# EAGLE design ece411-t09-GPSClock (EAGLE 9.5.1)
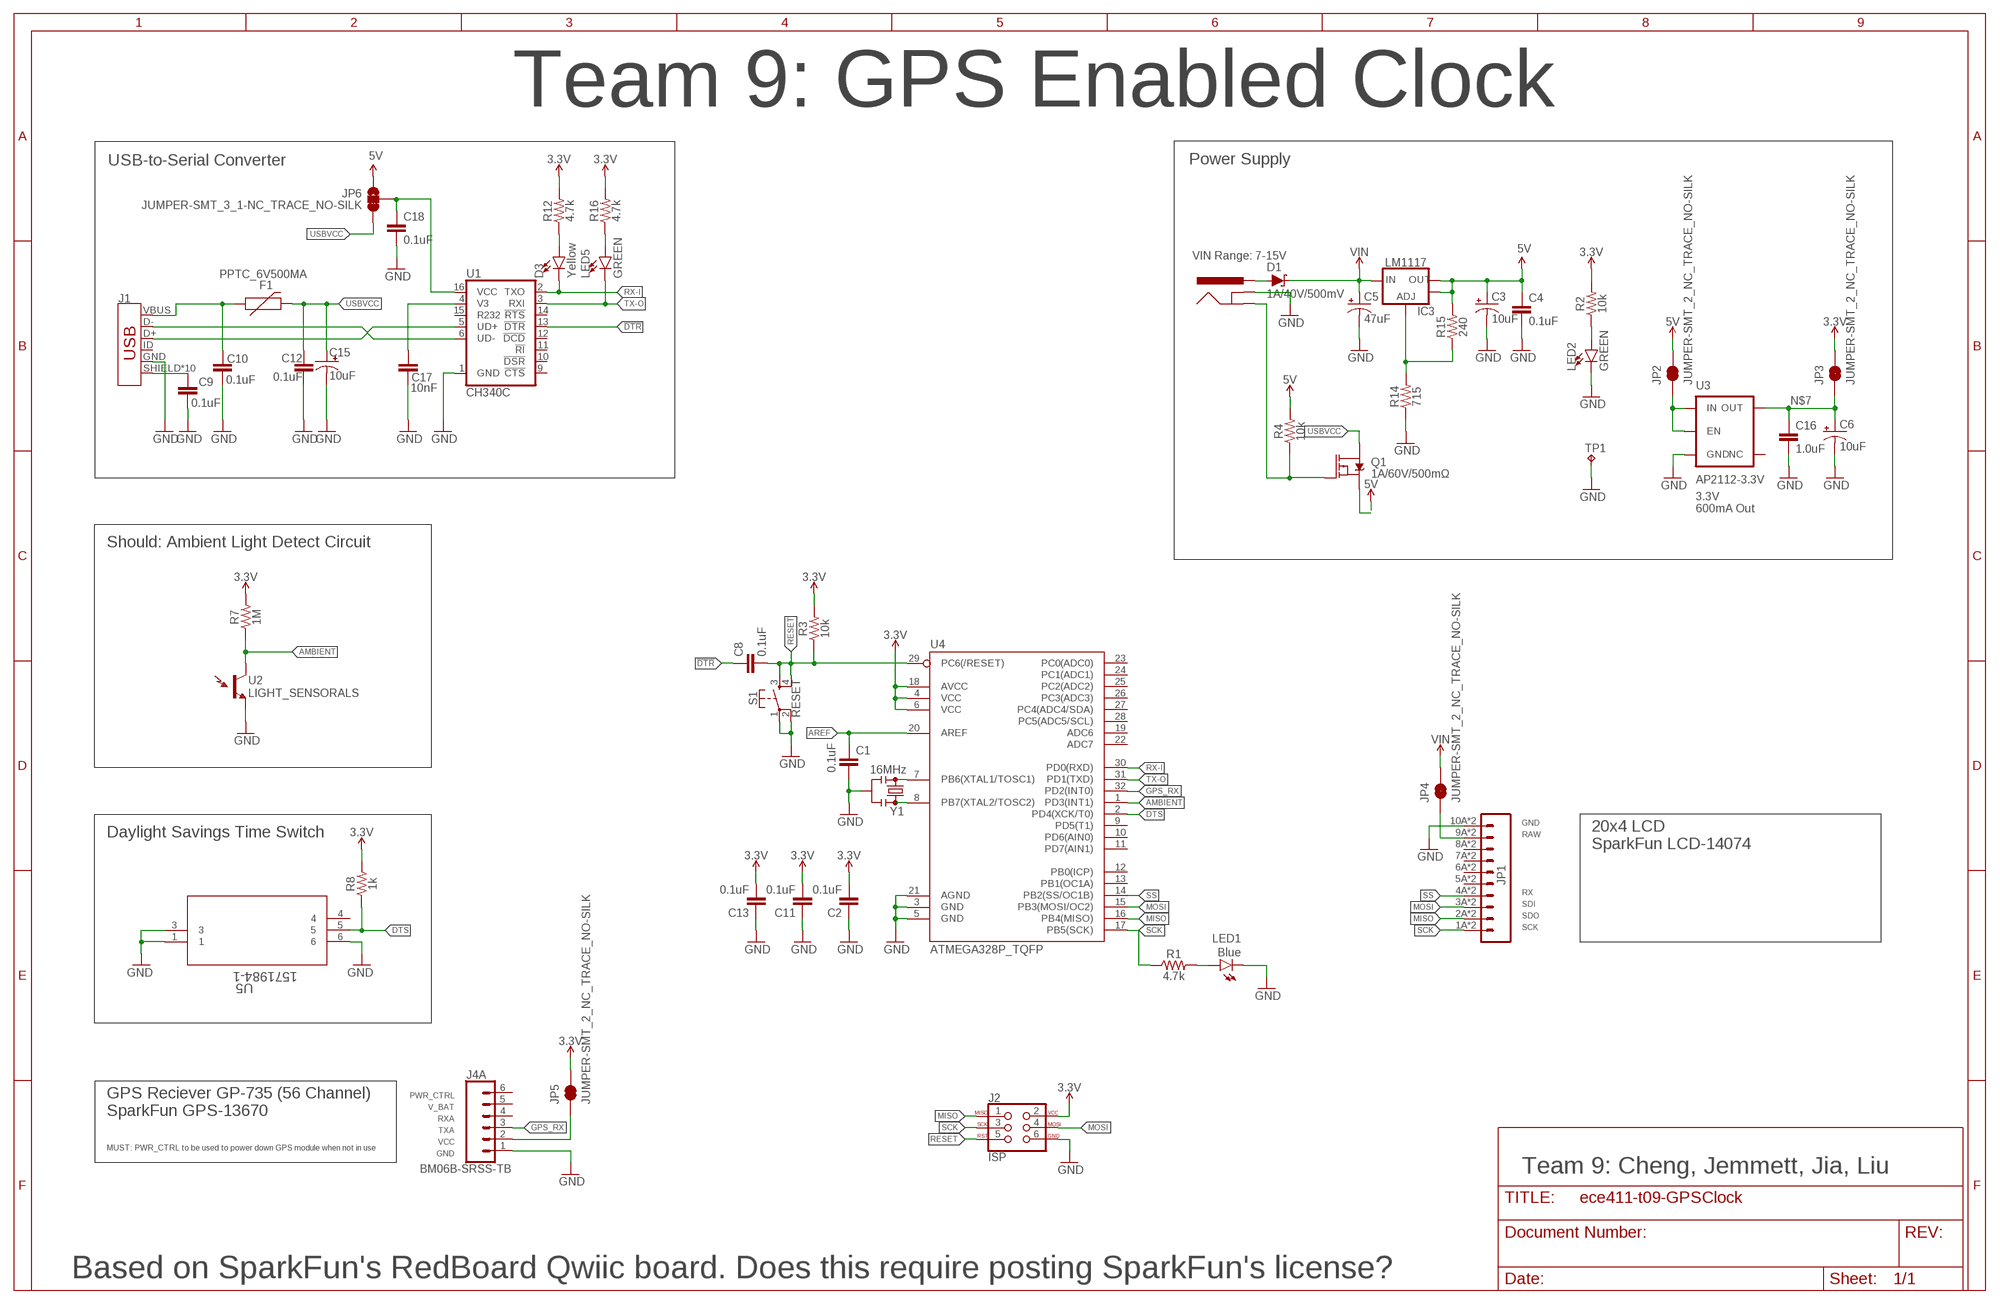
[diagram p0: schematic, sheet 1]

## Parts
C1  0.1uF  0.1UF-0603-25V-(+80/-20%)  [0603]
C2  0.1uF  0.1UF-0603-25V-(+80/-20%)  [0603]
C3  10uF  10UF-POLAR-EIA3216-16V-10%(TANT)  [EIA3216]
C4  0.1uF  0.1UF-0603-25V-(+80/-20%)  [0603]
C5  47uF  47UF-POLAR-PANASONIC_D-35V-20%  [PANASONIC_D]
C6  10uF  10UF-POLAR-EIA3216-16V-10%(TANT)  [EIA3216]
C8  0.1uF  0.1UF-0603-25V-(+80/-20%)  [0603]
C9  0.1uF  0.1UF-0603-25V-(+80/-20%)  [0603]
C10  0.1uF  0.1UF-0603-25V-(+80/-20%)  [0603]
C11  0.1uF  0.1UF-0603-25V-(+80/-20%)  [0603]
C12  0.1uF  0.1UF-0603-25V-(+80/-20%)  [0603]
C13  0.1uF  0.1UF-0603-25V-(+80/-20%)  [0603]
C15  10uF  10UF-POLAR-EIA3216-16V-10%(TANT)  [EIA3216]
C16  1.0uF  1.0UF-16V-10%(0603)  [0603-CAP]
C17  10nF  10NF/10000PF-50V-10%(0603)  [0603-CAP]
C18  0.1uF  0.1UF-0603-25V-(+80/-20%)  [0603]
D1  1A/40V/500mV  DIODE-SCHOTTKY-SS14  [SMA-DIODE]
D3  Yellow  LED-YELLOW_HIDDENSILK  [LED-1206-HIDDENSILK]
F1  PPTC_6V500MA  [0805]
IC3  LM1117  V_REG_LM1117ALT1  [SOT223-ALT1]
J1  AMP FCI 10103594-0001LF  USB_MICRO-B_HALF_PTH_MILL  [USB-MICROB-PTH-MILL]
J2  ISP  AVR_SPI_PROG_3X2SMD  [2X3_SMT_POSTS]
J3  POWER_JACKSUPER_BOMB_DIGITY  [POWER_JACK_SMD_OVERPASTE_SUPER_BOMB_DIGITY]
J4  BM06B-SRSS-TB  JST_6_PIN_HORIZONTAL  [JST-6-SMD-HORI-1.0MM]
JP1  M10SMD_COMBO  [1X10_SMD_COMBINED]
JP2  JUMPER-SMT_2_NC_TRACE_NO-SILK  [SMT-JUMPER_2_NC_TRACE_NO-SILK]
JP3  JUMPER-SMT_2_NC_TRACE_NO-SILK  [SMT-JUMPER_2_NC_TRACE_NO-SILK]
JP4  JUMPER-SMT_2_NC_TRACE_NO-SILK  [SMT-JUMPER_2_NC_TRACE_NO-SILK]
JP5  JUMPER-SMT_2_NC_TRACE_NO-SILK  [SMT-JUMPER_2_NC_TRACE_NO-SILK]
JP6  JUMPER-SMT_3_1-NC_TRACE_NO-SILK  [SMT-JUMPER_3_1-NC_TRACE_NO-SILK]
LED1  Blue  LED-BLUE_HIDDENSILK  [LED-1206-HIDDENSILK]
LED2  GREEN  LED-GREEN_HIDDENSILK  [LED-1206-HIDDENSILK]
LED5  GREEN  LED-GREEN_HIDDENSILK  [LED-1206-HIDDENSILK]
Q1  1A/60V/500mΩ  MOSFET-PCH-ZXMP6A13F  [SOT23-3]
R1  4.7k  4.7KOHM-0603-1/10W-1%  [0603]
R2  10k  10KOHM-0603-1/10W-1%  [0603]
R3  10k  10KOHM-0603-1/10W-1%  [0603]
R4  10k  10KOHM-0603-1/10W-1%  [0603]
R7  1M  1MOHM-0603-1/4W-5%  [0603]
R8  1k  1KOHM-0603-1/10W-1%  [0603]
R12  4.7k  4.7KOHM-0603-1/10W-1%  [0603]
R14  715  715OHM-0603-1/10W-1%  [0603]
R15  240  240OHM-0603-1/10W-1%  [0603]
R16  4.7k  4.7KOHM-0603-1/10W-1%  [0603]
S1  RESET  MOMENTARY-SWITCH-SPST-2-SMD-5.2MM-TALL  [TACTILE_SWITCH_SMD_5.2MM]
TP1  TP-063  [TP-063]
U1  CH340C  [SO016]
U2  LIGHT_SENSORALS  [ALS-PT19]
U3  AP2112-3.3V  V_REG_AP2112K-3.3V  [SOT23-5]
U4  ATMEGA328P_TQFP  [TQFP32-08]
U5  1571984-1  [SWITCH_1571984-1]
Y1  16MHz  RESONATOR-16MHZSMD_3.2X1.3  [RESONATOR-SMD-3.2X1.3]

## Nets
3.3V [power]: C2.2 C11.2 C13.2 J2.2 JP3.2 JP5.2 R2.2 R3.2 R7.2 R8.2 R12.2 R16.2 U4.4(VCC) U4.6(VCC) U4.18(AVCC)
5V: C3.+ C4.1 IC3.2(OUT) IC3.4(OUT) JP2.2 JP6.1 Q1.2(S) R4.2 R15.2
!DTR: C8.1 U1.13(!DTR)
AMBIENT: R7.1 U2.C(C1) U4.1(PD3(INT1))
AREF: C1.1 U4.20(AREF)
DTS: R8.1 U4.2(PD4(XCK/T0)) U5.5
GND: C1.2 C2.1 C3.- C4.2 C5.- C6.- C9.2 C10.2 C11.1 C12.2 C13.1 C15.- C16.2 C17.2 C18.2 J1.GND J2.6 J3.GND(GNDBREAK) J4.1 JP1.10A JP1.10B LED1.C LED2.C R14.1 S1.1 S1.2 TP1.1 U1.1(GND) U2.E(E1) U3.2(GND) U4.3(GND) U4.5(GND) U4.21(AGND) U5.1 U5.3 U5.6 Y1.2
GPS_RX: J4.3 U4.32(PD2(INT0))
INSERT: J3.P$4(GND) Q1.1(G) R4.1
MISO: J2.1 JP1.2A JP1.2B U4.16(PB4(MISO))
MOSI: J2.4 JP1.3A JP1.3B U4.15(PB3(MOSI/OC2))
N$1: LED1.A R1.2
N$2: LED2.A R2.1
N$3: U4.7(PB6(XTAL1/TOSC1)) Y1.1
N$4: U4.8(PB7(XTAL2/TOSC2)) Y1.3
N$5: LED5.A R16.1
N$6: C17.1 U1.4(V3)
N$7: C6.+ C16.1 JP3.1 U3.5(OUT)
N$8: JP2.1 U3.1(IN) U3.3(EN)
N$9: D3.A R12.1
N$10: JP1.9A JP1.9B JP4.1
N$11: J4.2 JP5.1
N$12: C18.1 JP6.2 U1.16(VCC)
N$13: J1.D- U1.6(UD-)
N$14: J1.D+ U1.5(UD+)
N$15: IC3.1(ADJ) R14.2 R15.1
PWRIN: D1.A J3.VIN0(PWR)
RESET: C8.2 J2.5 R3.1 S1.3 S1.4 U4.29(PC6(/RESET))
RX-I: D3.C U1.2(TXO) U4.30(PD0(RXD))
SCK: J2.3 JP1.1A JP1.1B R1.1 U4.17(PB5(SCK))
SHLD: C9.1 J1.SHIELD J1.SHIELD2(SHIELD) J1.SHIELD3(SHIELD) J1.SHIELD4(SHIELD) J1.SHIELD5(SHIELD) J1.SHIELD6(SHIELD) J1.SHIELD7(SHIELD) J1.SHIELD8(SHIELD) J1.SHIELD9(SHIELD) J1.SHIELD10(SHIELD)
SS: JP1.4A JP1.4B U4.14(PB2(SS/OC1B))
TX-O: LED5.C U1.3(RXI) U4.31(PD1(TXD))
USBVCC: C12.1 C15.+ F1.2 JP6.3 Q1.3(D)
VIN: C5.+ D1.C IC3.3(IN) JP4.2
VUSB: C10.1 F1.1 J1.VBUS
Unconnected: J1.ID J4.4 J4.5 J4.6 J4.M1 J4.M2 JP1.5A JP1.5B JP1.6A JP1.6B JP1.7A JP1.7B JP1.8A JP1.8B U1.9(!CTS) U1.10(!DSR) U1.11(!RI) U1.12(!DCD) U1.14(!RTS) U1.15(R232) U3.4(NC) U4.9(PD5(T1)) U4.10(PD6(AIN0)) U4.11(PD7(AIN1)) U4.12(PB0(ICP)) U4.13(PB1(OC1A)) U4.19(ADC6) U4.22(ADC7) U4.23(PC0(ADC0)) U4.24(PC1(ADC1)) U4.25(PC2(ADC2)) U4.26(PC3(ADC3)) U4.27(PC4(ADC4/SDA)) U4.28(PC5(ADC5/SCL)) U5.4

## Notes on the sheet
- Team 9: GPS Enabled Clock
- USB-to-Serial Converter | Power Supply
- VIN Range: 7-15V
- 3.3V
  600mA Out
- Should: Ambient Light Detect Circuit
- GND
- Daylight Savings Time Switch | RAW
- 20x4 LCD
  SparkFun LCD-14074
- RX
- SDI
- SDO
- SCK
- PWR_CTRL
- V_BAT
- GPS Reciever GP-735 (56 Channel)
  SparkFun GPS-13670
- RXA
- TXA
- VCC
- MUST: PWR_CTRL to be used to power down GPS module when not in use | GND
- Team 9: Cheng, Jemmett, Jia, Liu
- Based on SparkFun's RedBoard Qwiic board. Does this require posting SparkFun's license?

## Library data of the parts
C1 C2 C4 C8-C13 C18 = SparkFun-Capacitors:0.1UF: 0.1µF ceramic capacitors A capacitor is a passive two-terminal electrical component used to store electrical energy temporarily in an electric field.; PROD_ID: CAP-00810
C3 C6 C15 = SparkFun-Capacitors:10UF-POLAR: 10.0µF polarized capacitors A capacitor is a passive two-terminal electrical component used to store electrical energy temporarily in an electric field.; PROD_ID: CAP-00811
C5 = SparkFun-Capacitors:47UF-POLAR: 47µF polarized capacitors A capacitor is a passive two-terminal electrical component used to store electrical energy temporarily in an electric field.; PROD_ID: CAP-08478
C16 = SparkFun-Capacitors:1.0UF-16V-10%(0603): CAP-00868; PROD_ID: CAP-00868
C17 = SparkFun-Capacitors:10NF/10000PF-50V-10%(0603): CAP-00867; PROD_ID: CAP-00867
D1 = SparkFun-DiscreteSemi:DIODE-SCHOTTKY: Schottky diode A Schottky diode is a semiconductor diode which has a low forward voltage drop and a very fast switching action.; PROD_ID: DIO-08053
D3 = SparkFun-LED:LED-YELLOW: Yellow SMD LED Used in manufacturing several products at SparkFun. Packages: 0603 - SMD 0603 package[Product Link] <http://www.kingbrightusa.com/product.asp?catalog_name=LED&product_id=APT1608SYCK> 0603 -SMART - SMART SMD 0603 package (more efficient/more expensive) [Product Link] <http://www.osram-os.com/osram_os/en/products/product-catalog/led-light-emitting-diodes/smartled-0603/ly-l29k/index.jsp> LilyPad - SMD1206 package[Product Datasheet] <https://www.sparkfun.com/datasheets/DevTools/LilyPad/Q150YUS4.pdf> SparkFun Products: Blynk Board <https://www.sparkfun.com/products/13794> IOIO-OTG <https://www.sparkfun.com/products/13613> XBee Explorer Serial <https://www.sparkfun.com/products/13225>; PROD_ID: DIO-09909
F1 = SparkFun-Fuses:PPTC: Resettable Fuse PPTC Resettable Fuse. Really a sort of resistor with a polymeric positive temperature coefficient whose resistance increases dramatically with an increase in temperature. When heated by the power passing through the resistance rises causing the current to be limited, protecting the circuit. This is achieved by the transition of the polymer from a crystalline to an amorphous state where the conductive carbon separates breaking the conductive pathways found in the cool crystalline structure. When a PPTC cools back down it resumes conducting letting the circuit turn back on. SparkFun Products: SparkFun RedBoard - Programmed with Arduino <https://www.sparkfun.com/products/12757> Pro Micro - 5V/16MHz <https://www.sparkfun.com/products/12640> Arduino Pro 328 - 5V/16MHz <https://www.sparkfun.com/products/10915> MP3 Trigger <https://www.sparkfun.com/products/13720>
IC3 = Testing:V_REG_LM1117: Voltage Regulator LM1117 Standard adjustable voltage regulator but in SMD form. Spark Fun Electronics SKU : COM-00595; PROD_ID: VREG-08170
J1 = SparkFun-Connectors:USB_MICRO-B: USB Type Micro-B Connector Male/female and PTH/SMT variants SparkFun Products: SparkFun microB USB Breakout <https://www.sparkfun.com/products/12035> SparkFun USB microB Plug Breakout <https://www.sparkfun.com/products/10031> SparkFun ESP8266 Thing <https://www.sparkfun.com/products/13231>; PROD_ID: CONN-13711
J2 = SparkFun-Connectors:AVR_SPI_PROG_3X2: AVR ISP 6 Pin This is the reduced ISP connector for AVR programming. Common on Arduino. This footprint will take up less PCB space and can be used with a 10-pin to 6-pin adapter such as SKU: BOB-08508 **Special note about "TEST_POINT" package. The stop mask is on the top side, so if you want your programming test points to be on the bottom of your board, make sure to place this package on the bottom side of the board. This also ensure that the orientation to program from the bottom side will be correct.; PROD_ID: CONN-11415
J3 = Testing:POWER_JACK: Power Jack This is the standard 5.5mm barrel jack for power. The PTH is the most common, proven, reliable, footprint. All others are experimental. The Slot footprint only works if the mill layer is transmitted to the PCB fab house so be warned. Spark Fun Electronics SKU : PRT-00119. Mating wall wart : TOL-00298 (and others); PROD_ID: CONN-08106
J4 = SparkFun-Connectors:JST_6_PIN_HORIZONTAL: JST 6 pin horizontal connector JST-SH type. Here is the connector we sell at SparkFun: name <link> (XXX-00000) Datasheet <http://www.sparkfun.com/datasheets/GPS/EM406-SMDConnector-eSH.pdf> It was used on these SparkFun products: name <link> (XXX-00000) name <link> (XXX-00000); PROD_ID: XXX-00000
JP1 = SparkFun-Connectors:M10: Header 10 Standard 10-pin 0.1" header. Use with straight break away headers (SKU : PRT-00116), right angle break away headers (PRT-00553), swiss pins (PRT-00743), machine pins (PRT-00117), and female headers (PRT-00115).; PROD_ID: CONN-11219
JP2-JP5 = SparkFun-Jumpers:JUMPER-SMT_2_NC_TRACE: Normally closed trace jumper This jumper has a trace between two pads so it's normally closed (NC). Use a razor knife to open the connection. For best results follow the IPC guidelines for cutting traces: Cutout at least 0.063 mm (0.005 in). Remove all loose material to clean up the cut area. Seal the cut with an approved epoxy. Reapply solder to reclose the connection.
JP6 = SparkFun-Jumpers:JUMPER-SMT_3_1-NC_TRACE: Normally closed trace jumper (1 of 2 connections) This jumper has a trace between two pads so it's normally closed (NC). The other connection is normally open (NO). Use a razor knife to open the connection. For best results follow the IPC guidelines for cutting traces: Cutout at least 0.063 mm (0.005 in). Remove all loose material to clean up the cut area. Seal the cut with an approved epoxy. Reapply solder to reclose the connection, or to close the NO connection.
LED1 = SparkFun-LED:LED-BLUE: Blue SMD LED Used in manufacturing of various products at SparkFun Packages: 0603 - SMD 0603 package [Product Link] <http://www.digikey.com/product-detail/en/SMLE12BC7TT86/511-1589-2-ND/1641808> 1206 - SMD1206 package [Product Link] <http://www.digikey.com/product-detail/en/lite-on-inc/LTST-C150TBKT/160-1643-1-ND/573584> SparkFun Products: ESP8266 Thing-Dev Board <https://www.sparkfun.com/products/13711> RedBoard <https://www.sparkfun.com/products/12757>; PROD_ID: DIO-09911
LED2 = SparkFun-LED:LED-GREEN: Green SMD LED Used in manufacturing of various products at SparkFun Packages: 0603 - SMD 0603 package [Product Link] <http://www.futureelectronics.com/en/technologies/semiconductors/optoelectronics/leds/Pages/9894312-LTST-C190GKT.aspx?CrossPart=HSMG-C190&IM=0> LilyPad 1206 - SMD1206 LilyPad package [Product Link] <http://www.futureelectronics.com/en/Technologies/Product.aspx?ProductID=IN150NGHARVATEKCORPORATION2049943&IM=0> 1206 - SMD1206 package [Product Link] <http://www.futureelectronics.com/en/technologies/semiconductors/optoelectronics/leds/Pages/8315665-LTST-C150KGKT.aspx?IM=0> 1206 Bottom Mount -SMD 1206 Bottom Mount [Product Link] <http://www.digikey.com/product-detail/en/lite-on-inc/LTST-C230KGKT/160-1456-1-ND/386854> SparkFun Products: Pro Mini 328 -5V <https://www.sparkfun.com/products/821> RedBoard <https://www.sparkfun.com/products/12757> MP3 Trigger <https://www.sparkfun.com/products/13720> Makey Makey <https://www.sparkfun.com/products/11076>; PROD_ID: DIO-09910
LED5 = SparkFun-LED:LED-GREEN: Green SMD LED Used in manufacturing of various products at SparkFun Packages: 0603 - SMD 0603 package [Product Link] <http://www.futureelectronics.com/en/technologies/semiconductors/optoelectronics/leds/Pages/9894312-LTST-C190GKT.aspx?CrossPart=HSMG-C190&IM=0> LilyPad 1206 - SMD1206 LilyPad package [Product Link] <http://www.futureelectronics.com/en/Technologies/Product.aspx?ProductID=IN150NGHARVATEKCORPORATION2049943&IM=0> 1206 - SMD1206 package [Product Link] <http://www.futureelectronics.com/en/technologies/semiconductors/optoelectronics/leds/Pages/8315665-LTST-C150KGKT.aspx?IM=0> 1206 Bottom Mount -SMD 1206 Bottom Mount [Product Link] <http://www.digikey.com/product-detail/en/lite-on-inc/LTST-C230KGKT/160-1456-1-ND/386854> SparkFun Products: Pro Mini 328 -5V <https://www.sparkfun.com/products/821> RedBoard <https://www.sparkfun.com/products/12757> MP3 Trigger <https://www.sparkfun.com/products/13720> Makey Makey <https://www.sparkfun.com/products/11076>; PROD_ID: DIO-00862
Q1 = SparkFun-DiscreteSemi:MOSFET-PCH: P-channel MOSFETs Voltage controlled devices that allow control of high current outputs.; PROD_ID: TRANS-08285
R1 R12 R16 = SparkFun-Resistors:4.7KOHM: 4.7kΩ resistor A resistor is a passive two-terminal electrical component that implements electrical resistance as a circuit element. Resistors act to reduce current flow, and, at the same time, act to lower voltage levels within circuits. - Wikipedia; PROD_ID: RES-07857
R2-R4 = SparkFun-Resistors:10KOHM: 10kΩ resistor A resistor is a passive two-terminal electrical component that implements electrical resistance as a circuit element. Resistors act to reduce current flow, and, at the same time, act to lower voltage levels within circuits. - Wikipedia; PROD_ID: RES-00824
R7 = SparkFun-Resistors:1MOHM: 1MΩ resistor A resistor is a passive two-terminal electrical component that implements electrical resistance as a circuit element. Resistors act to reduce current flow, and, at the same time, act to lower voltage levels within circuits. - Wikipedia; PROD_ID: RES-07868
R8 = SparkFun-Resistors:1KOHM: 1kΩ resistor A resistor is a passive two-terminal electrical component that implements electrical resistance as a circuit element. Resistors act to reduce current flow, and, at the same time, act to lower voltage levels within circuits. - Wikipedia; PROD_ID: RES-07856
R14 = SparkFun-Resistors:715OHM: 715Ω resistor A resistor is a passive two-terminal electrical component that implements electrical resistance as a circuit element. Resistors act to reduce current flow, and, at the same time, act to lower voltage levels within circuits.; PROD_ID: RES-07850
R15 = SparkFun-Resistors:240OHM: 240Ω resistor A resistor is a passive two-terminal electrical component that implements electrical resistance as a circuit element. Resistors act to reduce current flow, and, at the same time, act to lower voltage levels within circuits.; PROD_ID: RES-07849
S1 = SparkFun-Switches:MOMENTARY-SWITCH-SPST-2: Momentary Switch (Pushbutton) - SPST - Two Circuits Normally-open (NO) SPST momentary switches (buttons, pushbuttons). Schematic symbol includes two switch circuits. Variants SMD-4.6MMX2.8MM - 4.60mm x 2.80mm Tactile Momentary Button Switch - Used on SparkFun SAMD21 Mini Breakout <https://www.sparkfun.com/products/13664> SMD-5.2MM - Mini Pushbutton Switch - SMD <https://www.sparkfun.com/products/8720> - Used on Arduino Pro Mini <https://www.sparkfun.com/products/11114>; PROD_ID: SWCH-14139
TP1 = keystone:TP: TEST POINT PCB Vertical Mount
U1 = SparkFun-IC-Comms:CH340C; PROD_ID: IC-14038
U2 = SparkFun-Sensors:LIGHT_SENSOR: Ambient Light Sensors - Phototransistors Low cost ambient light sensors, consisting of a phototransistor in miniature SMD packages. Output voltage varies with light intensity. SparkFun Products ALS-PT19 Light Sensor <https://www.sparkfun.com/products/12566> (SEN-12566) Ambient Light Sensor - TEMT6000 <https://www.sparkfun.com/products/8348> (SEN-08348) SparkFun Ambient Light Sensor Breakout - TEMT60000 <https://www.sparkfun.com/products/8688> (SEN-08688); PROD_ID: IC-11836; SF_ID: SEN-12566
U3 = SparkFun-PowerIC:V_REG_AP2112: AP2112 - 600mA CMOS LDO Regulator w/ Enable The AP2112 is CMOS process low dropout linear regulator with enable function, the regulator delivers a guaranteed 600mA (min.) continuous load current. Features Output Voltage Accuracy: ±1.5% Output Current: 600mA (Min.) Foldback Short Current Protection: 50mA Enable Function to Turn ON/OFF VOUT Low Dropout Voltage (3.3V): 250mV (Typ.) @IOUT=600mA Excellent Load Regulation: 0.2%/A (Typ.) Excellent Line Regulation: 0.02%/V (Typ.) Low Quiescent Current: 55μA (Typ.) Low Standby Current: 0.01μA (Typ.) Low Output Noise: 50μVRMS PSRR: 100Hz -65dB, 1kHz -65dB OTSD Protection Stable with 1.0μF Flexible Cap: Ceramic, Tantalum and Aluminum Electrolytic Operation Temperature Range: -40°C to 85°C ESD: MM 400V, HBM 4000V; PROD_ID: VREG-12457; VALUE: 3.3V
U4 = SparkFun-IC-Microcontroller:ATMEGA328P_TQFP; PROD_ID: IC-09069
U5 = TE 1571984-1:1571984-1; MANUFACTURER_PART_NUMBER: 15719841; VENDOR: TE Connectivity
Y1 = SparkFun-Clocks:RESONATOR-16MHZ: 16MHz Resonator Digikey Example <http://www.digikey.com/product-detail/en/murata-electronics-north-america/CSTCE16M0V53-R0/490-1198-1-ND/584635> Frequency: 16MHz Frequency Stability: ±0.3% Frequency Tolerance: ±0.5% Capacitance: 15pF; PROD_ID: XTAL-08900

## Net classes
1 power: width 0.178 mm

## Board
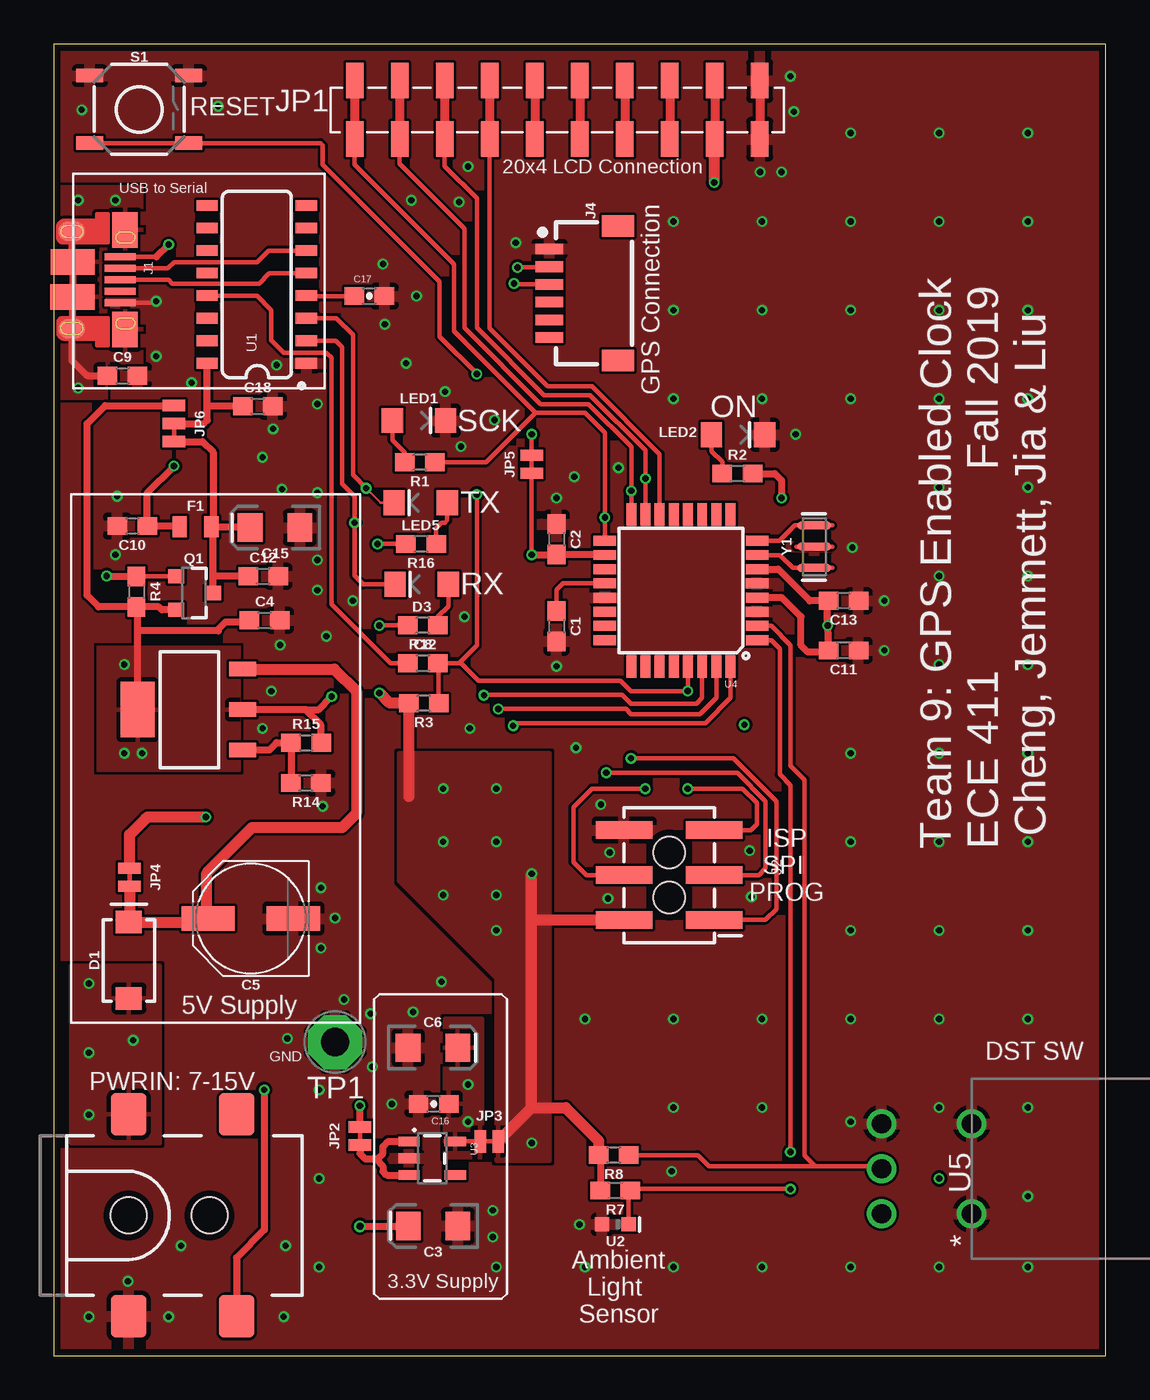
[diagram p1: board, top side]
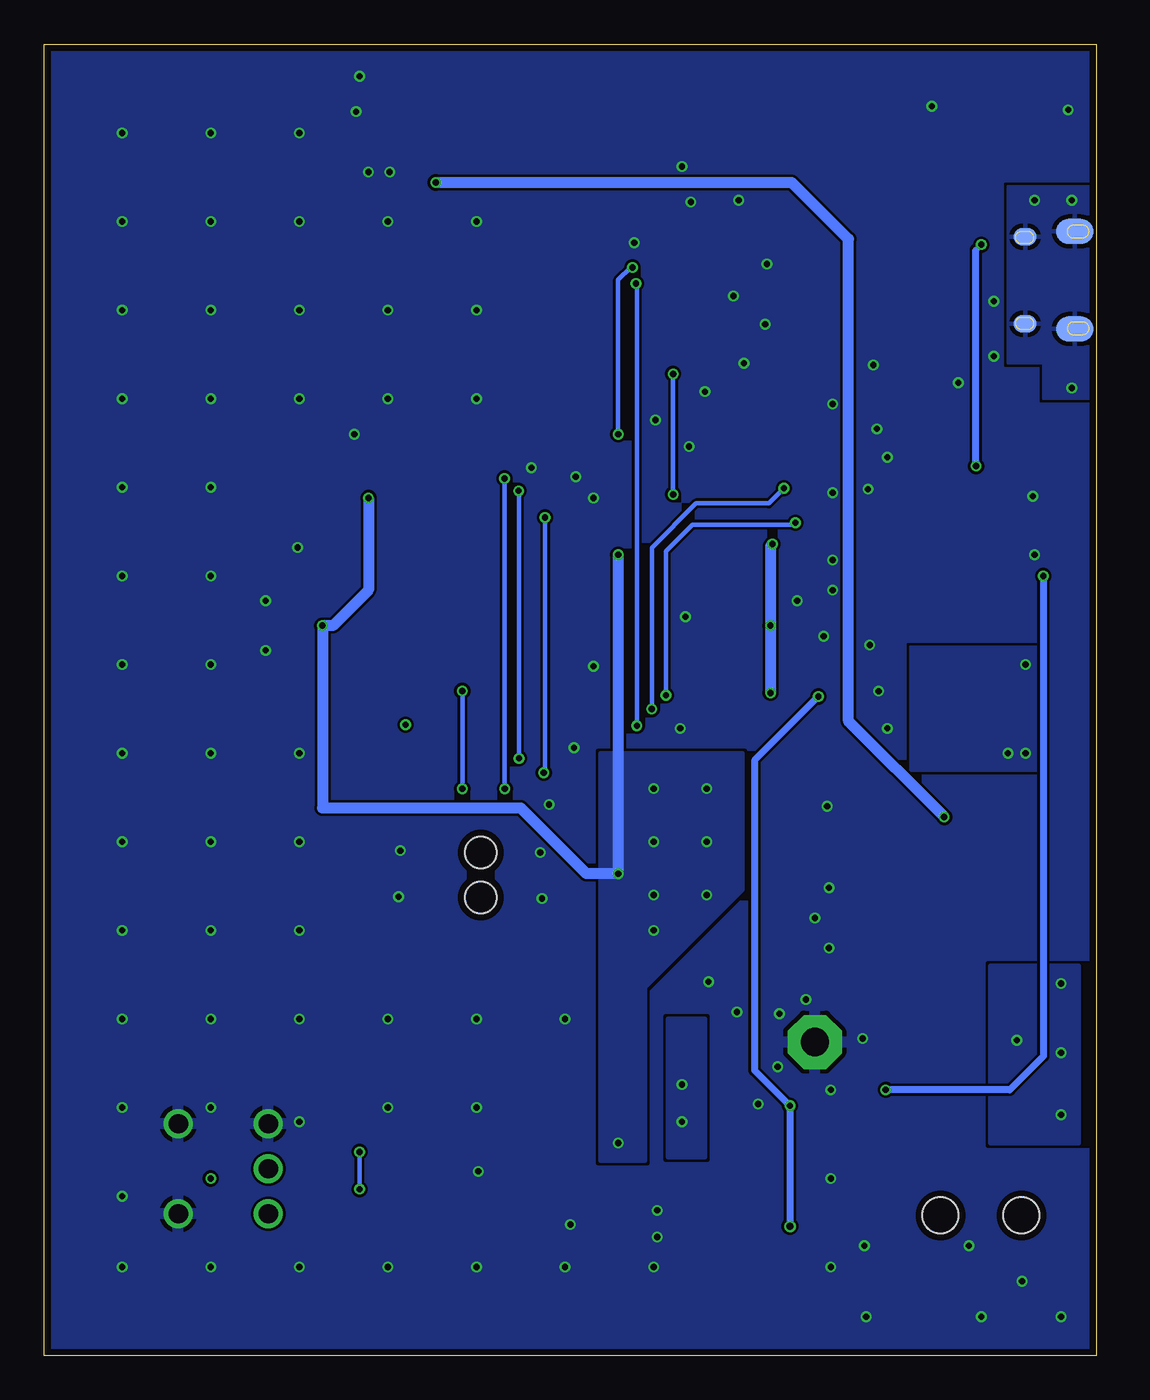
[diagram p2: board, bottom side, seen from below]

Size 59.4 x 74 mm. Coordinates in mm from the lower left corner, seen from the top.
Outline: 0,0 59.4,0 59.4,74 0,74 0,0
Copper layers (1*16): Top 0.035559375mm / dielectric 1.6mm / Bottom 0.035559375mm
Design rules "oshpark-2layer": minimum track width 6mil, minimum drill 10mil, track to track 6mil, track to pad 6mil, pad to pad 6mil, via to via 6mil, smd to smd 6mil, copper to edge 15mil, drill to drill 6mil, minimum pad ring 5mil, minimum via ring 5mil, stop-mask expansion 2.5mil, vias tented up to drill 0mil, thermal gap 10mil

### Footprints (pad centres in the part's own frame; a part is rotated, then mirrored left to right if it is on the bottom)
0603 = smd 1.1 x 1: 1 -0.85,0; 2 0.85,0
EIA3216 = smd 1.4 x 1.6: + 1.4,0; - -1.4,0
PANASONIC_D = smd 3 x 1.4: + 2.4,0; - -2.4,0
0603-CAP = smd 1.1 x 1: 1 -0.85,0; 2 0.85,0
SMA-DIODE = smd 1.27 x 1.47: A -2.15,0; C 2.15,0
LED-1206-HIDDENSILK = smd 1.2 x 1.4: A -1.5,0; C 1.5,0
0805 = smd 0.8 x 1.2: 1 -0.9,0; 2 0.9,0
SOT223-ALT1 = smd 0.813 x 1.524: 1 -2.271,-3.02; 2 0,-3.02; 3 2.288,-3.02 | smd 3.124 x 1.905: 4 0,2.921
USB-MICROB-PTH-MILL = smd 0.4 x 1.75: D+ 0.031,1.331; D- -0.619,1.331; GND 1.331,1.331; ID 0.681,1.331; VBUS -1.269,1.331 | smd 2 x 1.46: SHIELD -2.794,1.606; SHIELD2 2.831,1.606 | smd 1.425 x 2.5: SHIELD3 -0.979,-1.349; SHIELD4 0.996,-1.352 | smd 1.4 x 2.1 bottom: SHIELD5 -2.7,-1.2; SHIELD7 2.8,-1.2 | smd 1.1 x 1.5: SHIELD6 2.8,-1.4; SHIELD8 -2.7,-1.4 | smd 1 x 1.3 bottom: SHIELD9 -2.4,1.6; SHIELD10 2.5,1.6
2X3_SMT_POSTS = smd 1 x 3.17: 1 -2.54,-2.54; 2 -2.54,2.54; 3 0,-2.54; 4 0,2.54; 5 2.54,-2.54; 6 2.54,2.54 | hole 1.8: -1.27,0; 1.27,0
POWER_JACK_SMD_OVERPASTE_SUPER_BOMB_DIGITY = smd 2 x 2.4: GND 0,-5.7; P$4 6.1,-5.7; VIN0 0,5.7; VIN1 6.1,5.7 | hole 2.032: 0,0; 4.572,0
JST-6-SMD-HORI-1.0MM = smd 0.6 x 1.55: 1 -2.5,-4.775; 2 -1.5,-4.775; 3 -0.5,-4.775; 4 0.5,-4.775; 5 1.5,-4.775; 6 2.5,-4.775 | smd 1.2 x 1.8: M1 -3.8,-0.9; M2 3.8,-0.9
1X10_SMD_COMBINED = smd 1 x 2: 1A 0,1.65; 1B 0,-1.65; 2A 2.54,1.65; 2B 2.54,-1.65; 3A 5.08,1.65; 3B 5.08,-1.65; 4A 7.62,1.65; 4B 7.62,-1.65; 5A 10.16,1.65; 5B 10.16,-1.65; 6A 12.7,1.65; 6B 12.7,-1.65; 7A 15.24,1.65; 7B 15.24,-1.65; 8A 17.78,1.65; 8B 17.78,-1.65; 9A 20.32,1.65; 9B 20.32,-1.65; 10A 22.86,1.65; 10B 22.86,-1.65
SMT-JUMPER_2_NC_TRACE_NO-SILK = smd 0.635 x 1.27: 1 -0.508,0; 2 0.508,0
SMT-JUMPER_3_1-NC_TRACE_NO-SILK = smd 0.635 x 1.27: 1 -1.016,0; 2 0,0; 3 1.016,0
SOT23-3 = smd 0.8 x 0.9: 1 -0.95,-1; 2 0.95,-1; 3 0,1.1
TACTILE_SWITCH_SMD_5.2MM = smd 1.524 x 0.762: 1 -2.794,1.905; 2 2.794,1.905; 3 -2.794,-1.905; 4 2.794,-1.905
TP-063 = drill 1.6 pad 3.048 octagon: 1 0,0
SO016 = smd 0.6 x 1.2: 1 -4.445,-2.8; 2 -3.175,-2.8; 3 -1.905,-2.8; 4 -0.635,-2.8; 5 0.635,-2.8; 6 1.905,-2.8; 7 3.175,-2.8; 8 4.445,-2.8; 9 4.445,2.8; 10 3.175,2.8; 11 1.905,2.8; 12 0.635,2.8; 13 -0.635,2.8; 14 -1.905,2.8; 15 -3.175,2.8; 16 -4.445,2.8
ALS-PT19 = smd 0.8 x 0.8: C -0.75,0; E 0.75,0
SOT23-5 = smd 0.55 x 1.2: 1 -0.95,-1.3; 2 0,-1.3; 3 0.95,-1.3; 4 0.95,1.3; 5 -0.95,1.3
TQFP32-08 = smd 1.27 x 0.559: 1 -4.293,2.8; 2 -4.293,2; 3 -4.293,1.2; 4 -4.293,0.4; 5 -4.293,-0.4; 6 -4.293,-1.2; 7 -4.293,-2; 8 -4.293,-2.8; 17 4.293,-2.8; 18 4.293,-2; 19 4.293,-1.2; 20 4.293,-0.4; 21 4.293,0.4; 22 4.293,1.2; 23 4.293,2; 24 4.293,2.8 | smd 0.559 x 1.27: 9 -2.8,-4.293; 10 -2,-4.293; 11 -1.2,-4.293; 12 -0.4,-4.293; 13 0.4,-4.293; 14 1.2,-4.293; 15 2,-4.293; 16 2.8,-4.293; 25 2.8,4.293; 26 2,4.293; 27 1.2,4.293; 28 0.4,4.293; 29 -0.4,4.293; 30 -1.2,4.293; 31 -2,4.293; 32 -2.8,4.293
SWITCH_1571984-1 = drill 1.092 pad 1.6: 1 -5.08,0; 3 0,0; 4 -5.08,5.08; 5 -2.54,5.08; 6 0,5.08
RESONATOR-SMD-3.2X1.3 = smd 0.45 x 1.905: 1 -1.2,0; 2 0,0; 3 1.2,0

### Placement (x,y rotation side)
C1  28.4,41.16 270 top
C2  28.4,46.07 270 top
C3  21.43,7.32 180 top
C4  11.92,41.5 0 top
C5  11.14,24.67 180 top
C6  21.42,17.38 0 top
C8  20.86,39.08 0 top
C9  3.9,55.3 0 top
C10  4.45,46.82 180 top
C11  44.6,39.8 180 top
C12  11.84,43.98 0 top
C13  44.6,42.6 180 top
C15  12.51,46.73 180 top
C16  21.46,14.21 180 top
C17  17.83,59.79 0 top
C18  11.53,53.58 0 top
D1  4.25,22.31 90 top
D3  20.79,43.53 180 top
F1  8.02,46.77 0 top
IC3  7.67,36.46 90 top
J1  2.43,60.74 270 top
J2  34.76,27.12 90 top
J3  4.24,7.92 0 top
J4  32.77,59.95 270 top
JP1  17.01,70.3 0 top
JP2  17.3,12.4 90 top
JP3  24.6,12.1 0 top
JP4  4.3,27 270 top
JP5  27,50.3 270 top
JP6  6.8,52.6 270 top
LED1  20.63,52.77 0 top
LED2  38.65,51.97 0 top
LED5  20.73,48.13 180 top
Q1  7.92,43.04 270 top
R1  20.68,50.42 180 top
R2  38.61,49.78 0 top
R3  20.9,36.82 180 top
R4  4.68,43.11 270 top
R7  31.72,9.32 180 top
R8  31.63,11.32 180 top
R12  20.84,41.22 180 top
R14  14.25,32.32 180 top
R15  14.26,34.59 0 top
R16  20.75,45.81 180 top
S1  4.84,70.33 0 top
TP1  15.9,17.7 0 top
U1  11.48,60.45 90 top
U2  31.72,7.41 180 top
U3  21.38,11.14 270 top
U4  35.42,43.18 180 top
U5  51.83,13.09 90 top
Y1  42.95,45.65 90 top

### Tracks (layer width: path | path; a pad name or v marks a point on that pad's centre or on a via)
3.3V  (via drill 0.35)
  Top 0.254: JP5.2 v27,45.2 | 43.7,42.55 C13.2 | C11.2 43.65,39.7 | v18.4,41.2 18.42,41.22 R12.2 | v18.3,45.8 v18.31,45.81 R16.2
  Top 0.406: U4.6 40.92,44.38 42.7,42.6 C13.2 | R2.2 40.72,49.78 41.1,49.4 v41.1,48.4 | 43.7,42.55 v43.7,41.2 C11.2 | 43.65,39.7 42.6,39.7 42.2,40.1 42.2,41.7 41.12,42.78 U4.4 | 27.08,24.58 27,24.5 | R8.2 30.87,11.23 R7.2 | v27,45.2 28.38,45.2 C2.2 31.09,45.22 U4.18
  Top 0.61: 20.05,31.55 R3.2 18.98,36.82 v18.4,37.4 | JP3.2 27,13.99 | 27,13.99 27,24.5 v27,27.2 | 27,13.99 28.91,13.99 30.78,12.12 R8.2 | J2.2 27.08,24.58
  Bottom 0.61: v18.3,45.8 18.4,45.7 v18.4,41.2 v18.4,37.4 | v27,45.2 v27,27.2 28.8,27.2 32.5,30.9 43.7,30.9 v43.7,41.2 43.1,41.2 41.1,43.2 v41.1,48.4
  other vias: 22,32 25,32 22,29 22,26 25,29 25,26 25,24 27,12
  pour Top: 25,11 25,21.3 19.5,26.8 19.5,34 28,34 28,11
  pour Bottom: 25.5,11 25.5,20.8 20,26.3 20,34 28,34 28,11
5V  (via drill 0.35, 0.4)
  Top 0.152: R15.2 | 4.75,42.19 R4.2
  Top 0.406: R15.2 15.1,35.6 14.24,36.46 | 14.24,36.46 IC3.2 | Q1.2 6.11,42.09 5.94,42.26 R4.2 2.54,42.26 1.9,42.9 1.9,52.6 2.92,53.62 JP6.1 | IC3.4 4.75,41 | 4.75,41 4.75,42.19 | 14.24,36.46 14.96,36.46 v15.7,37.2 | JP2.2 v17.3,14.1 | C4.1 10.97,41.4 9.7,41.4 9.3,41 9.3,40.9 4.85,40.9 4.75,41 | v17.3,7.3 20.01,7.3 C3.+
  Bottom 0.406: v15.7,37.2 19.3,33.6 19.3,16.1 v17.3,14.1 v17.3,7.3
  other vias: 5,34 4,34 4,39
  pour Top: 10.5,40 10.5,33 2.5,33 2.5,40
  pour Bottom: 2.5,40 10.5,40 10.5,33 2.5,33
!DTR
  Top 0.254: U1.13 11.48,59.81 12.3,59 12.3,57.3 13,56.6 15.4,56.6 15.7,56.3 15.7,42.4 19.02,39.08 C8.1
AMBIENT  (via drill 0.35)
  Top 0.152: 32.47,9.22 R7.1 32.67,9.42 | 41.58,9.42 v41.6,9.4
  Top 0.254: U2.C 32.47,9.22 | U4.1 40.52,40.38 41,39.9 41,32.8 41.6,32.2 v41.6,11.5 | 41.58,9.42 32.67,9.42
  Bottom 0.254: v41.6,9.4 v41.6,11.5
AREF
  Top 0.254: U4.20 28.77,43.58 28.4,43.21 C1.1
DTS
  Top 0.152: U5.5 46.6,10.7
  Top 0.254: R8.1 36.38,11.32 37,10.7 43,10.7 | 46.6,10.7 43,10.7 | U4.2 40.52,41.18 41.6,40.1 41.6,33.3 42.4,32.5 42.4,11.3 43,10.7
GND  (via drill 0.35)
  Top 0.254: J1.GND 5.71,59.41 v5.8,59.5
  other vias: 9.3,70.5 7.8,54.9 5.8,56.4 11.8,50.7 29.4,49.6 19.9,56 30.9,31.1 28.4,38.9 28.4,48.4 41.9,52 46.9,42.6 46.9,39.8 45.1,45.6 31.4,28.4 15.1,26.4 15.9,24.7 15.1,23 13,2.2 2,2.2 13.2,17.9 16.4,20.1 40,14 35,14 30,19 35,19 40,19 45,19 50,19 55,19 55,14 55,9 50,14 45,24 50,24 55,24 55,29 50,29 45,29 45,34 50,34 55,34 50,39 55,39 50,44 55,44 35,54 40,54 50,49 55,49 55,54 50,54 45,54 35,59 40,59 45,59 50,59 55,59 35,64 40,64 45,64 50,64 55,64 55,69 50,69 45,69 34.9,10.4 6.5,2.2 11.8,35.4 12.3,37.5 16.9,42.6 23.5,35.4 29.5,34.3 15.2,31 20.3,19.4 17.9,19.3 18,16.3 24.8,8.2 24.8,6.7 19.1,14.2 45,13.2 29.7,7.4 15.4,40.6 12.8,40.1 14.9,43.2 14.9,44.9 14.9,48.7 12.9,48.9 3.5,45.2 3.6,48.5 12.4,52.3 14.9,53.7 12.6,55.9 18.6,61.6 20.5,59.8 18.7,58.2 1.6,70.3 39.9,66.8 41.1,66.8 41.8,70.2 41.6,72.2 26.1,62.8 24.9,52.8 23,51.3 22.1,54.4 23.2,41.7 31.9,50.1 31.3,25.8 39.4,25.9 39.3,28.5 21.9,21.1 20.2,65.2 22.9,65.1 23.4,67.1 7.2,6.2 13.1,6.2 4.2,4.2 55,5 50,5 45,5 40,5 35,5 30,5 25,5 15,5 15,10 15,15
  pour Top (rank 2): 0,74 0,0 59.5,0 59.5,74
  pour Bottom (rank 2): 0,74 59.5,74 59.5,0 0,0
GPS_RX  (via drill 0.35)
  Top 0.152: 26.05,60.45 v26,60.5
  Top 0.254: U4.32 38.22,37.12 36.8,35.7 26.1,35.7 v25.95,35.55 | J4.3 26.05,60.45
  Bottom 0.254: v25.95,35.55 25.95,60.45 v26,60.5
INSERT  (via drill 0.35)
  Top 0.152: R4.1 4.71,43.99
  Top 0.254: 4.71,43.99 Q1.1
  Top 0.406: R4.1 3.04,43.96 v3,44 | v11.9,15 11.9,7.1 10.34,5.54 J3.P$4
  Bottom 0.406: v3,44 3,16.9 4.9,15 v11.9,15
MISO  (via drill 0.35)
  Top 0.152: J2.1 37.32,24.6
  Top 0.254: 37.32,24.6 40.2,24.6 40.8,25.2 40.8,31.3 38.39,33.71 v32.6,33.71 | U4.16 v32.62,48.8 32.62,51.28 30.2,53.7 27.5,53.7 23.2,58 23.2,63.6 19.55,67.25 JP1.2B JP1.2A
  Bottom 0.254: v32.6,33.71 32.6,48.78 v32.62,48.8
MOSI  (via drill 0.35)
  Top 0.254: J2.4 30.08,27.12 29.35,27.85 29.35,30.95 30.39,31.99 v33.4,31.99 | U4.15 v33.42,49.5 33.42,51.08 30.3,54.2 27.7,54.2 23.9,58 23.9,65.3 22.09,67.11 JP1.3B JP1.3A
  Bottom 0.152: 33.42,32.01 v33.4,31.99
  Bottom 0.254: v33.42,49.5 33.42,32.01
N$1
  Top 0.254: LED1.A 19.13,51.67 19.83,50.97 R1.2
N$2
  Top 0.254: LED2.A 37.15,51.05 37.76,50.44 R2.1
N$3
  Top 0.254: U4.7 41.02,45.18 41.75,44.45 Y1.1
N$4
  Top 0.254: U4.8 40.98,45.98 41.85,46.85 Y1.3
N$5
  Top 0.254: LED5.A 22.23,47.13 22.1,47 21.9,47 21.6,46.7 R16.1
N$6
  Top 0.152: U1.4 14.3,59.79
  Top 0.254: 14.3,59.79 C17.1
N$7  (via drill 0.35)
  Top 0.254: JP3.1 U3.5
  other vias: 23.4,13.2 23.4,15.3
  pour Bottom: 22.1,19 22.1,11.2 24.2,11.2 24.2,19
  pour Top: 22.1,19 22.1,11.2 24.2,11.2 24.2,19
N$8
  Top 0.152: 18.2,11.1 18.3,11.1
  Top 0.406: JP2.1 17.3,11.4 17.6,11.1 18.2,11.1 18.6,10.7 18.6,10.4 18.81,10.19 U3.3 | 18.3,11.1 18.6,11.4 18.6,11.8 18.89,12.09 U3.1
N$9
  Top 0.152: D3.A
  Top 0.254: R12.1 21.69,41.69 22.3,42.3 D3.A
N$10  (via drill 0.35)
  Top 0.152: 5.2,30.3 5.3,30.4
  Top 0.406: JP1.9B JP1.9A
  Top 0.61: JP4.1 4.3,29.4 5.2,30.3 | 5.3,30.4 v8.6,30.4 | v37.3,66.2 37.3,68.62 JP1.9B
  Bottom 0.61: v8.6,30.4 14,35.8 14,63 17.2,66.2 v37.3,66.2
N$11  (via drill 0.35)
  Top 0.152: 27.95,61.41 J4.2
  Top 0.254: JP5.1 v27,52 | v26.2,61.41 27.95,61.41
  Bottom 0.152: 26.29,61.41 v26.2,61.41
  Bottom 0.254: v27,52 27,60.7 26.29,61.41
N$12
  Top 0.152: 8.7,53.58 8.68,53.6
  Top 0.254: 8.5,52.6 8.68,52.78
  Top 0.406: JP6.2 8.5,52.6 | 8.68,52.78 8.68,53.6 U1.16 | C18.1 8.7,53.58
N$13
  Top 0.254: U1.6 12.15,62.35 11.5,61.7 6.8,61.7 6.46,61.36 J1.D-
N$14
  Top 0.254: U1.5 12.19,61.09 11.6,60.5 6.7,60.5 6.49,60.71 J1.D+
N$15
  Top 0.152: R14.2
  Top 0.406: R14.2 R15.1 12.59,34.59 12.19,34.19 IC3.1
N$16  (via drill 0.35)
  other vias: 39,35.6
N$27  (via drill 0.35)
  other vias: 50,10
PWRIN  (via drill 0.35)
  other vias: 2,21 2,17.1 2,13.6 4.5,17.8
  pour Top: 1,12 6,12 6,22 1,22
  pour Bottom: 1,22 1,12 6,12 6,22
RESET  (via drill 0.35)
  Top 0.152: 21.75,39.04 C8.2 | 15.07,68.42 15.2,68.3 | 35.82,37.53 v35.8,37.51
  Top 0.254: R3.1 21.75,39.04 | C8.2 22.9,39.08 | J2.5 39.36,29.66 39.7,30 39.7,31.2 38.9,32 v35.81,32 v35.8,31.99 | S1.3 S1.4 15.07,68.42 | 15.2,68.3 15.2,67.2 21.8,60.6 21.8,57.5 v23.9,55.4 | 22.9,39.08 23.9,40.08 v23.9,48.6 | U4.29 35.82,37.53 | v35.8,37.51 32.59,37.51 32.02,38.08 24,38.08 23,39.08 22.9,39.08
  Bottom 0.254: v23.9,55.4 v23.9,48.6 | v35.8,31.99 v35.8,37.51
RX-I  (via drill 0.35)
  Top 0.152: 24.33,37.3 v24.3,37.27
  Top 0.254: U1.2 15.93,57.27 16.3,56.9 16.3,49.2 17,48.5 v17,47 17,44 17.47,43.53 D3.C | U4.30 36.62,37.12 36.3,36.8 32.6,36.8 32.1,37.3 24.33,37.3
  Bottom 0.254: v24.3,37.27 24.3,45.4 22.8,46.9 17.1,46.9 v17,47
SCK  (via drill 0.35)
  Top 0.254: 27.2,53.2 22.6,57.8 22.6,61.6 17.01,67.19 JP1.1B JP1.1A | U4.17 v31.13,47.3 31.13,52.07 30,53.2 27.2,53.2 | R1.1 24.42,50.42 27.2,53.2 | J2.3 39.82,27.12 40.2,27.5 40.2,31.3 38.6,32.9 v31.2,32.9
  Bottom 0.254: v31.13,47.3 31.13,32.97 v31.2,32.9
SHLD  (via drill 0.35)
  Top 0.406: C9.1 1.9,55.3 1.03,56.17 J1.SHIELD6 1.08,57.99 J1.SHIELD4 J1.SHIELD3 1.03,61.77 J1.SHIELD8
  other vias: 1.4,54.6 1.4,65.2 3.5,65.2
  pour Top: 3,54 0,54 0,66 5,66 5,56 3,56
  pour Bottom: 0,66 5,66 5,56 3,56 3,54 0,54
SS
  Top 0.254: U4.14 34.22,50.88 30.4,54.7 27.9,54.7 24.63,57.97 JP1.4B JP1.4A
TX-O  (via drill 0.35)
  Top 0.152: LED5.C 18.47,48.13 v17.65,48.95
  Top 0.254: U1.3 15.96,58.55 16.9,57.6 16.9,49.7 v17.65,48.95 | v25.11,36.49 32.31,36.49 32.6,36.2 36.5,36.2 37.42,37.12 U4.31
  Bottom 0.254: v17.65,48.95 18.5,48.1 22.6,48.1 25.11,45.59 v25.11,36.49
USBVCC
  Top 0.152: F1.2 9,46.77 9.02,46.75 | 11.07,46.77 C15.+
  Top 0.406: 11.07,46.77 9,46.77 9,51 8.42,51.58 JP6.3 | Q1.3 9.02,44 | 9.02,44 9.02,46.75 | C12.1 9.04,43.98 9.02,44
VIN
  Top 0.152: 4.3,24.51 D1.C
  Top 0.61: IC3.3 15.85,38.75 17.1,37.5 17.1,30.6 16.3,29.8 11.2,29.8 8.65,27.25 8.65,24.76 | 8.65,24.76 8.65,24.46 D1.C | JP4.2 4.3,24.51 | 8.65,24.76 C5.+
VUSB  (via drill 0.35)
  Top 0.152: 7.07,46.82 F1.1
  Top 0.254: 5.81,62.01 J1.VBUS
  Top 0.406: 7.07,46.82 C10.1 5.3,48.7 v6.8,50.2 | v6.5,62.7 5.81,62.01
  Bottom 0.152: 6.8,62.4 v6.5,62.7
  Bottom 0.406: v6.8,50.2 6.8,62.4

### Text on the board
tPlace: RESET | 20x4 LCD Connection | USB to Serial | GPS Connection | ON | SCK | TX | RX | Team 9: GPS Enabled Clock / ECE 411 Fall 2019 / Cheng, Jemmett, Jia & Liu | ISP / SPI / PROG | 5V Supply | GND | DST SW | PWRIN: 7-15V | 3.3V Supply | Ambient / Light / Sensor